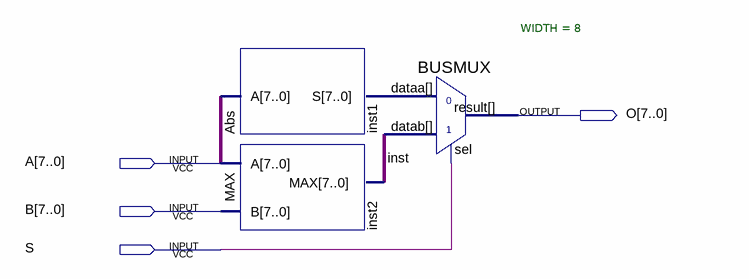
[diagram p0: schematic sheet]
// Quartus schematic ABS_MAX.bdf as structural Verilog: 3 symbols, 4 pins
module ABS_MAX (
  input  [7:0] A,
  input  [7:0] B,
  input  S,
  output [7:0] O
);

  wire [7:0] inst1_s, inst2_max;

  Abs inst1 (.A(A), .S(inst1_s));
  MAX inst2 (.A(A), .B(B), .MAX(inst2_max));
  BUSMUX #(.WIDTH(8)) inst (.datab(inst2_max), .sel(S), .dataa(inst1_s), .result(O));
endmodule
